# EAGLE schematic open_collector (EAGLE 6.4)
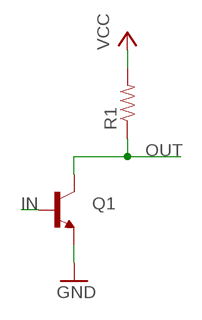
[diagram p0: schematic, sheet 1]

## Parts
Q1  TRANSISTOR_NPN"  [SOT223]
R1  RESISTOR0402-RES  [0402-RES]

## Nets
GND: Q1.3(E)
IN: Q1.1(B)
OUT: Q1.2(C) R1.1
VCC: R1.2

## Library data of the parts
Q1 = SparkFun-DiscreteSemi:TRANSISTOR_NPN: Generic NPN BJT. MMBT2222 is the common NPN we use. Double check against datasheet- not all devices are the same!
R1 = SparkFun-Passives:RESISTOR: Resistor Basic schematic elements and footprints for 0603, 1206, and PTH resistors.